# EasyEDA Pro project 旋变解码板_v2.2.epro, board PCB1_7
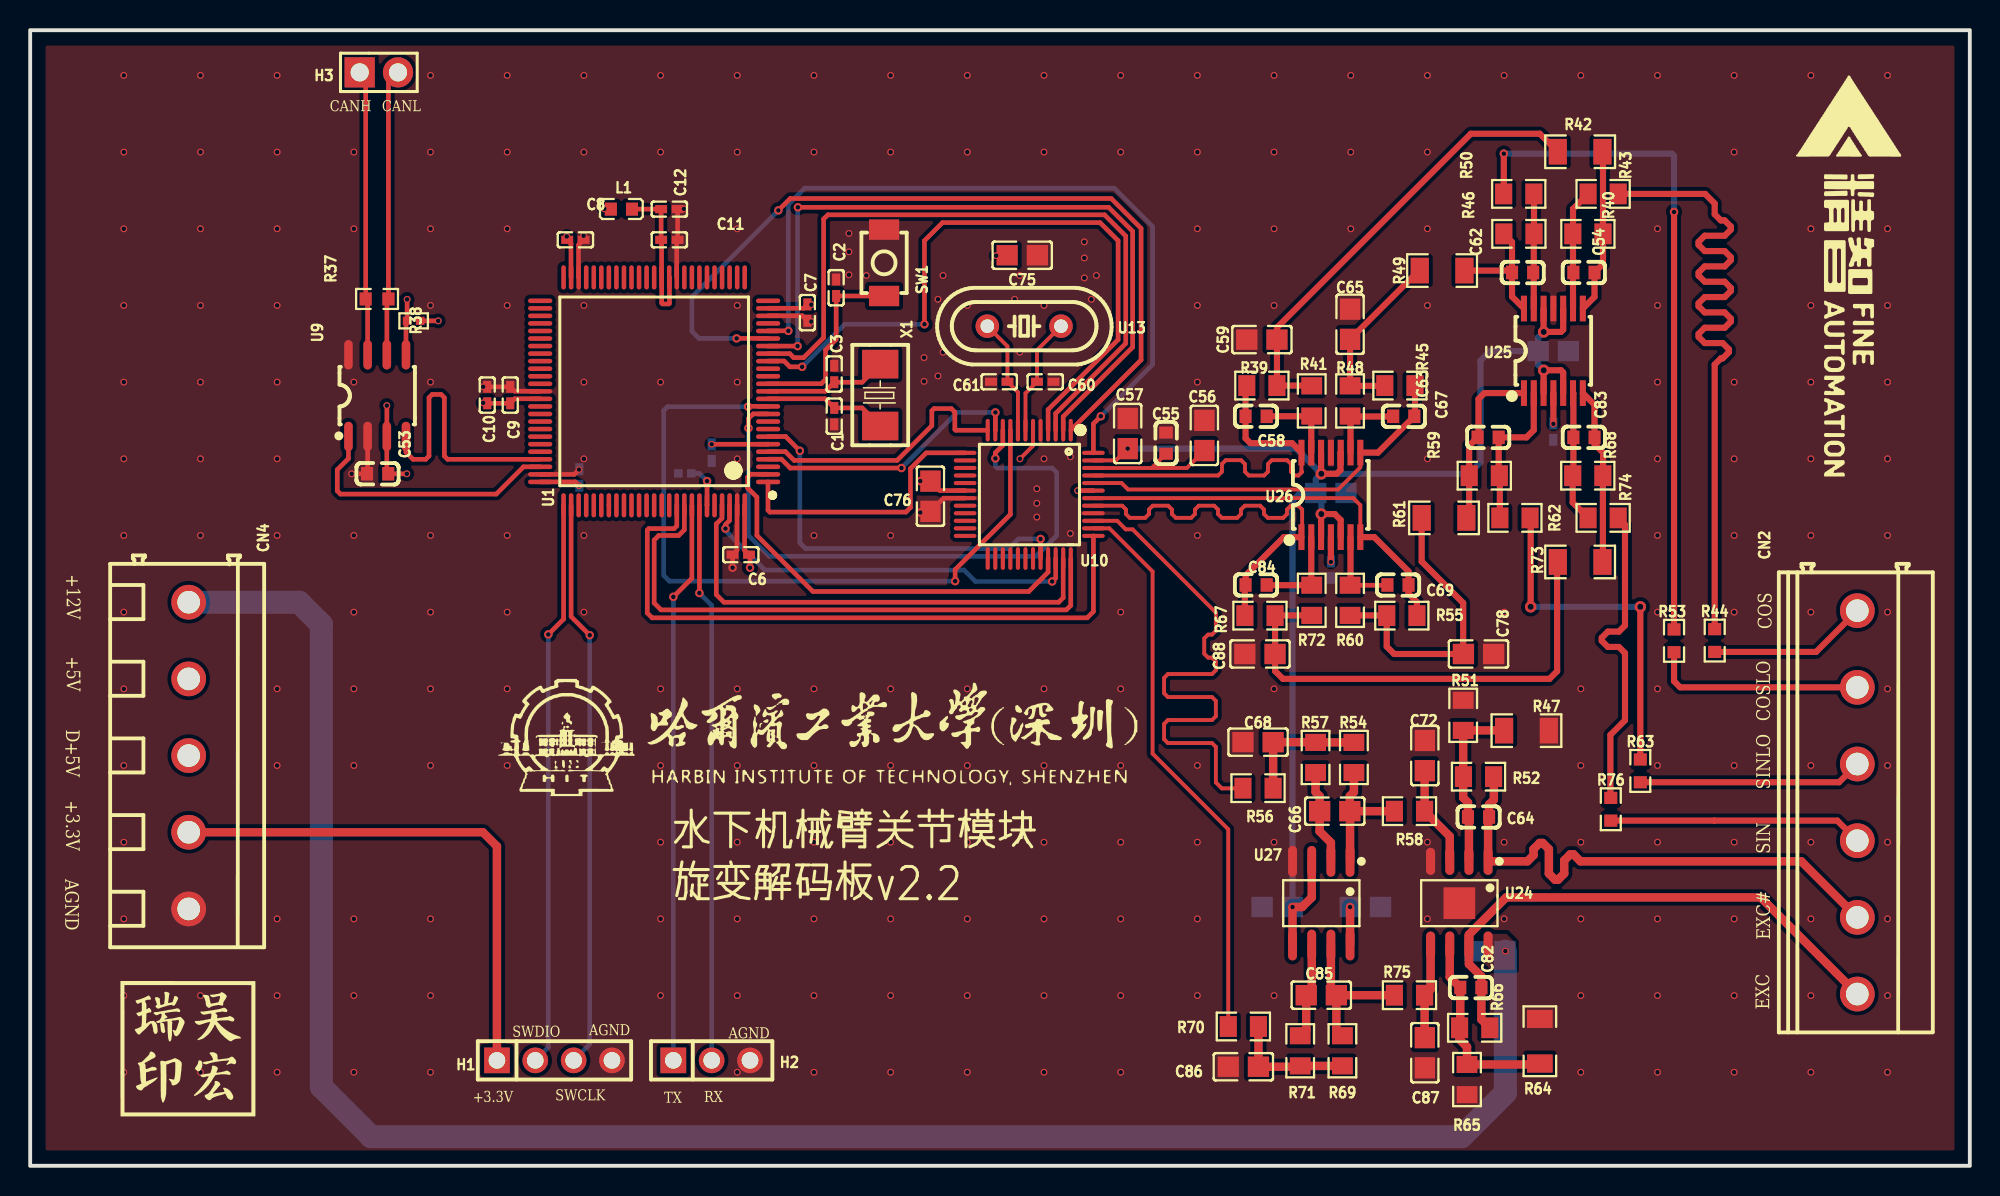
[diagram p4: board, top side]
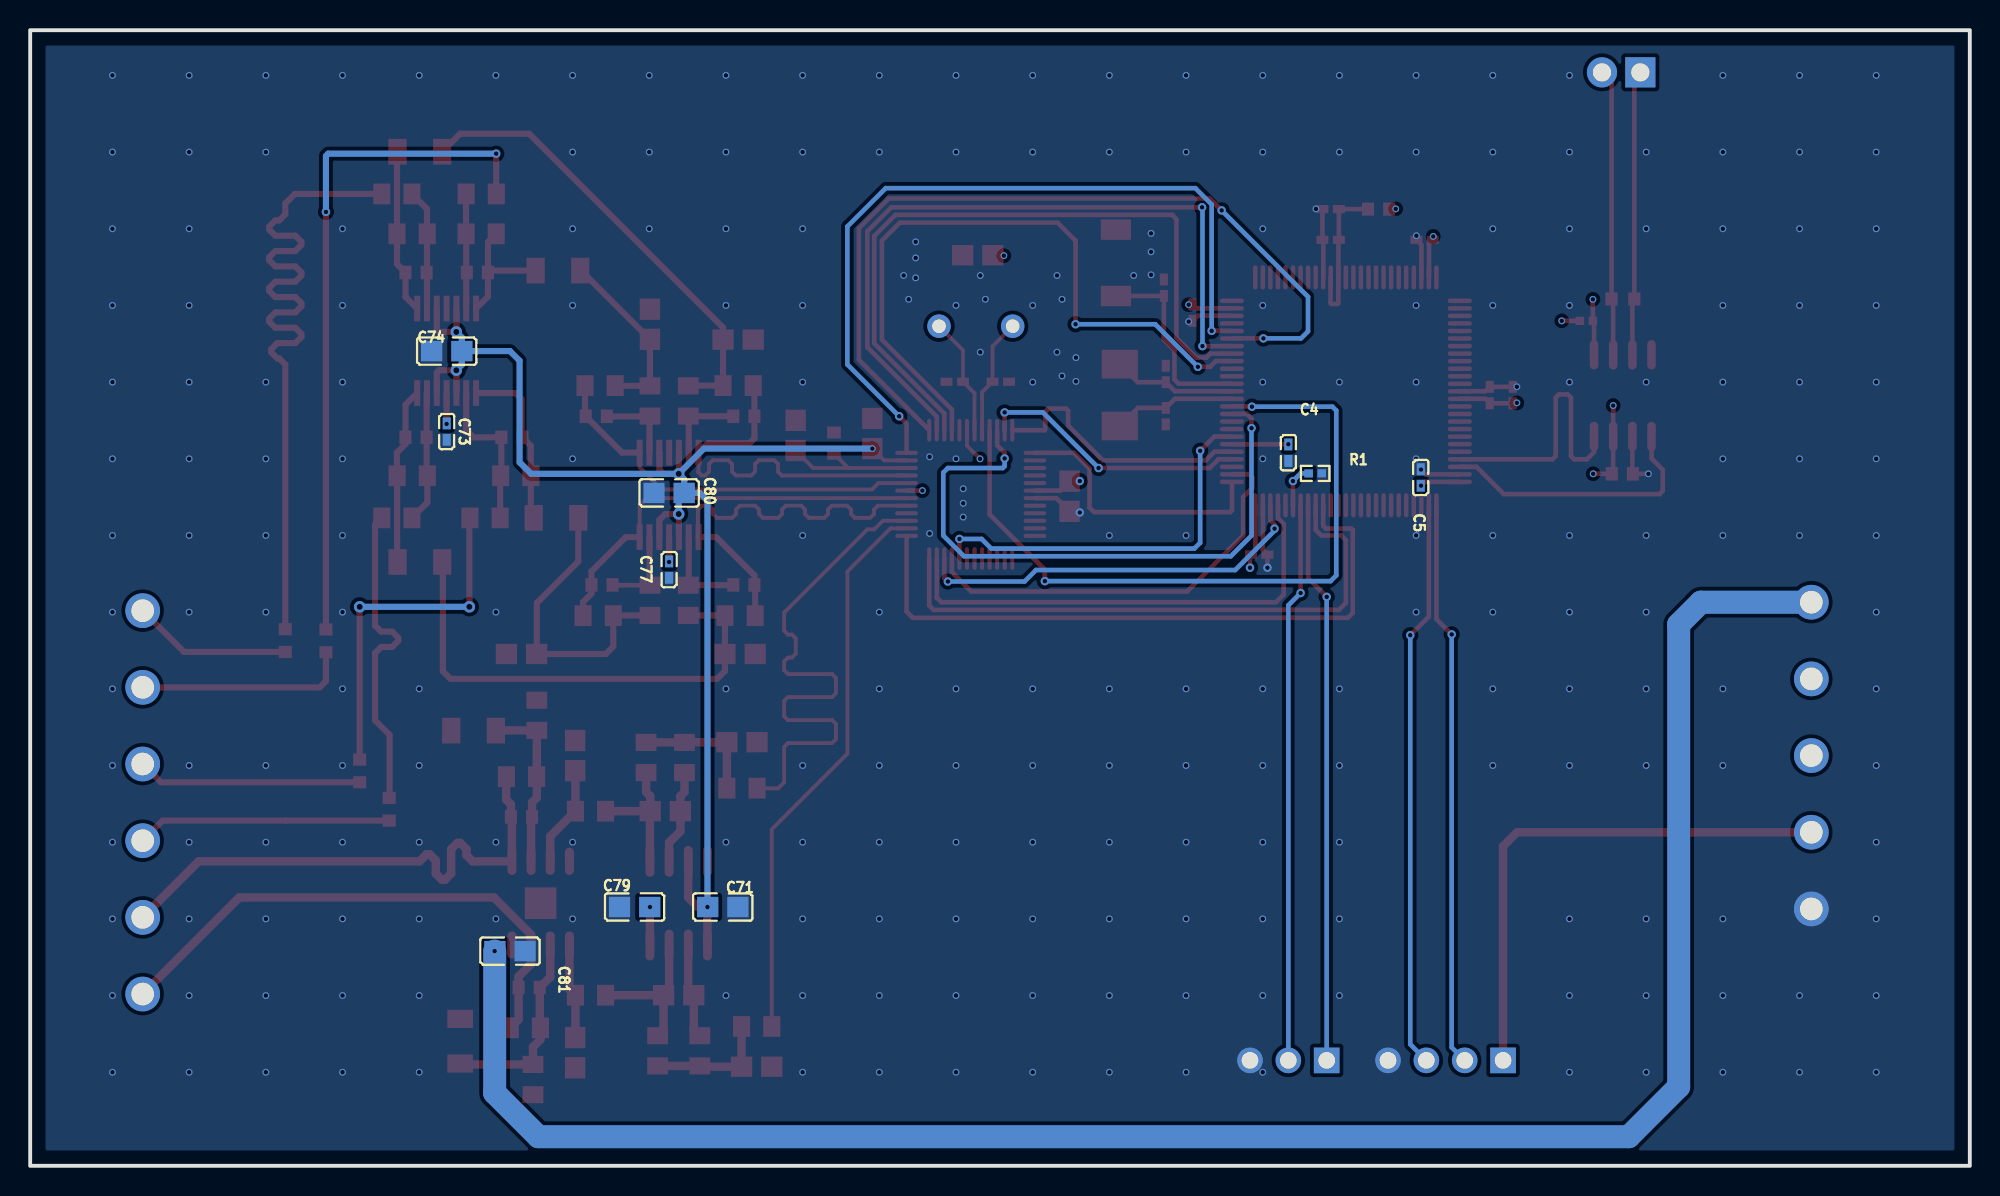
[diagram p5: board, bottom side, seen from below]

Outline 128.49 x 75.23 mm; copper layers: Top Layer, GND, PWR, Bottom Layer. Coordinates in mm from the lower left corner of the outline.
Outline path: rectangle 0,75.23 128.49,0
Stack: Top Layer 0.035mm 外层铜厚1oz / Dielectric1 0.2104mm 7628 RC49% 8.6mil / GND 0.0152mm 内层铜厚 / Dielectric2 1.065mm 1.1mm H/HOZ 含铜 / PWR 0.0152mm 内层铜厚 / Dielectric3 0.2104mm 7628 RC49% 8.6mil / Bottom Layer 0.035mm 外层铜厚1oz

## Design rules (mm)
net RX: USART
net TX: USART
net SWCLK: SWD
net SWDIO: SWD
net CAN_TX: CAN_TR
net CAN_RX: CAN_TR
net OSC_OUT: OSC
net OSC_IN: OSC
net DB14: AD2S1210_SPI
net DB15: AD2S1210_SPI
net CANH: CAN_HL
net CANL: CAN_HL
net EXC: EXC
net EXC#: EXC
net SIN: SIN
net SINLO: SIN
net COSLO: COS
net COS: COS
template: 自定义配置
spacing copperThickness1oz (default): track to track 0.102, other pairs 0.152 to 0.3
spacing copperThickness2oz: track to track 0.203, other pairs 0.152 to 0.3
track width copperThickness1oz (default): min 0.127, default 0.305, max 2.54
track width copperThickness2oz: min 0.203, default 0.254, max 2.54
differential pair differentialPair (default): width min 0.254, default 0.305, max 0.406; gap min 0.152, default 0.152
via viaSize (default): diameter min 0.254, default 0.457, max 10; hole min 0.3, default 0.305, max 6.299

## Placement (name value [footprint] x y rotation side)
C1  30pF  [C0402]  53.26 49.66 270 top
C2  100nF  [C0402]  53.39 58.17 270 top
C3  30pF  [C0402]  53.26 52.46 90 top
C4  100nF  [C0402]  45.14 47.24 90 bottom
C5  100nF  [C0402]  36.37 45.6 270 bottom
C6  100nF  [C0402]  47.07 40.49 0 top
C7  100nF  [C0402]  51.49 56.52 90 top
C8  100nF  [C0402]  36.12 61.35 180 top
C9  100nF  [C0402]  31.8 51.06 270 top
C10  4.7uF  [C0402]  30.28 51.06 270 top
C11  100nF  [C0402]  42.34 61.35 180 top
C12  1uF  [C0402]  42.34 63.38 180 top
C53  100nF  [C0603]  23.02 45.85 0 top
C54  120pF  [C0603]  102.93 59.18 0 top
C55  10nF  [C0603]  75.24 47.88 270 top
C56  10uF  [C0805]  77.78 48.39 270 top
C57  100nF  [C0805]  72.7 48.51 270 top
C58  680pF  [C0603]  81.21 49.66 0 top
C59  3.9nF  [C0805]  81.59 54.74 0 top
C60  30pF  [C0402]  67.24 51.94 0 top
C61  30pF  [C0402]  64.19 51.94 180 top
C62  120pF  [C0603]  98.86 59.18 180 top
C63  680pF  [C0603]  90.99 49.66 180 top
C64  2.7nF  [C0603]  95.94 23.11 180 top
C65  3.9nF  [C0805]  87.43 55.75 270 top
C66  56pF  [C0805]  86.42 23.5 0 top
C67  120pF  [C0603]  96.58 48.26 180 top
C68  470pF  [C0805]  81.34 28.07 0 top
C69  680pF  [C0603]  90.61 38.48 180 top
C71  100nF  [C0805]  82.61 17.14 0 bottom
C72  2.2nF  [C0805]  92.39 27.18 90 top
C73  1uF  [C0402]  100.9 48.64 90 bottom
C74  100nF  [C0805]  100.9 53.97 180 bottom
C75  100nF  [C0805]  65.72 60.33 180 top
C76  100nF  [C0805]  59.64 44.36 90 top
C77  1uF  [C0402]  86.17 39.5 90 bottom
C78  3.9nF  [C0805]  95.94 33.91 180 top
C79  10uF  [C0805]  88.45 17.14 180 bottom
C80  100nF  [C0805]  86.17 44.58 180 bottom
C81  10uF  [C0805]  96.71 14.22 0 bottom
C82  2.7nF  [C0603]  95.44 11.81 180 top
C83  120pF  [C0603]  102.93 48.26 0 top
C84  680pF  [C0603]  81.21 38.48 0 top
C85  56pF  [C0805]  85.53 11.3 0 top
C86  470pF  [C0805]  80.37 6.56 0 top
C87  2.2nF  [C0805]  92.39 7.49 270 top
C88  3.9nF  [C0805]  81.47 33.91 0 top
CN2  DB128V-5.08-6P-GN-S  [CONN-TH_6P-P5.08_DIBO_DB128V-5.08]  121.04 24.08 270 top
CN4  DB128V-5.08-5P-GN-S  [CONN-TH_5P-P5.08_DIBO_DB128V-5.08-5P-GN-S]  10.5 27.18 270 top
H1  PZ254V-11-04P  [HDR-TH_4P-P2.54-V-M]  34.73 6.99 0 top
H2  PZ254V-11-03P  [HDR-TH_3P-P2.54-V-M]  45.14 6.99 0 top
H3  PZ254V-11-02P  [HDR-TH_2P-P2.54-V-M]  23.1 72.44 0 top
L1  GZ1608D601TF  [L0603]  39.17 63.38 0 top
R1  10kΩ  [R0402]  43.37 45.87 180 bottom
R37  120Ω  [R0603]  22.98 57.43 180 top
R38  510Ω  [R0402]  25.4 55.98 0 top
R39  2kΩ  [R0805]  81.59 51.69 180 top
R40  22kΩ  [R0805]  103.19 61.74 0 top
R41  1.2kΩ  [R0805]  84.89 50.67 90 top
R42  4.7kΩ  [R1206]  102.67 67.18 0 top
R43  27kΩ  [R0805]  104.2 64.39 180 top
R44  0Ω  [R0603]  111.59 34.8 270 top
R45  2kΩ  [R0805]  90.74 51.69 0 top
R46  22kΩ  [R0805]  98.62 61.74 180 top
R47  750Ω  [R1206]  99.12 28.83 180 top
R48  1.2kΩ  [R0805]  87.43 50.67 90 top
R49  4.7kΩ  [R1206]  93.53 59.31 0 top
R50  27kΩ  [R0805]  98.61 64.39 0 top
R51  3.3kΩ  [R0805]  94.93 29.84 270 top
R52  910Ω  [R0805]  95.94 25.78 0 top
R53  0Ω  [R0603]  108.9 34.78 270 top
R54  20kΩ  [R0805]  87.69 27.05 270 top
R55  2kΩ  [R0805]  90.86 36.45 0 top
R56  20kΩ  [R0805]  81.34 25.02 0 top
R57  6.2kΩ  [R0805]  85.15 27.05 270 top
R58  820Ω  [R0805]  91.37 23.5 0 top
R59  22kΩ  [R0805]  96.33 45.72 180 top
R60  1.2kΩ  [R0805]  87.43 37.47 270 top
R61  4.7kΩ  [R1206]  93.66 42.93 0 top
R62  27kΩ  [R0805]  98.36 42.93 180 top
R63  0Ω  [R0603]  106.66 26.16 270 top
R64  750Ω  [R1206]  100.01 8.25 270 top
R65  3.3kΩ  [R0805]  95.18 5.72 90 top
R66  910Ω  [R0805]  95.69 9.14 0 top
R67  2kΩ  [R0805]  81.47 36.45 180 top
R68  22kΩ  [R0805]  103.18 45.72 0 top
R69  20kΩ  [R0805]  86.93 7.62 90 top
R70  20kΩ  [R0805]  80.37 9.23 0 top
R71  6.2kΩ  [R0805]  84.13 7.62 90 top
R72  1.2kΩ  [R0805]  84.89 37.47 270 top
R73  4.7kΩ  [R1206]  102.67 40 0 top
R74  27kΩ  [R0805]  104.2 42.93 180 top
R75  820Ω  [R0805]  91.37 11.3 0 top
R76  0Ω  [R0603]  104.71 23.62 270 top
SW1  TS-1185-B-B-B-A  [SW-SMD_L4.0-W3.0-LS5.0]  56.57 59.82 270 top
U1  STM32G474VET6  [LQFP-100_L14.0-W14.0-P0.50-LS16.0-BL]  41.33 51.31 90 top
U9  TJA1050T/CM,118  [SOIC-8_L5.0-W4.0-P1.27-LS6.0-BL]  22.99 51.02 0 top
U10  AD2S1210BSTZ  [LQFP-48_L7.0-W7.0-P0.50-LS9.0-BL]  66.18 44.48 180 top
U13  TX49S8.192M2LDBE2S  [HC-49S_L11.5-W5.0-P4.88]  65.85 55.63 180 top
U24  -  [SOP-8_L4.9-W3.9-P1.27-LS6.0-BL-EP2.1]  94.67 17.4 180 top
U25  -  [TSSOP-14_L5.0-W4.5-P0.65-LS6.4-BL]  100.9 54 0 top
U26  -  [TSSOP-14_L5.0-W4.5-P0.65-LS6.4-BL]  86.17 44.45 0 top
U27  AD8692ARZ-REEL7  [SOIC-8_L4.9-W3.9-P1.27-LS6.0-BL]  85.53 17.4 180 top
X1  8MHz  [CRYSTAL-SMD_L5.0-W3.2]  56.31 51.06 270 top

## Footprints (pads in the part's own frame, mm; a bottom-side part is the same pattern mirrored in y, then rotated)
C0402
  rect 0.79x0.54 smd: 1(-0.545,0) 2(0.545,0)
C0603
  rect 0.8x0.9 smd: 1(-0.7,0) 2(0.7,0)
C0805
  rect 1.41x1.35 smd: 1(-1,0) 2(1,0)
CONN-TH_5P-P5.08_DIBO_DB128V-5.08-5P-GN-S
  round 2.3 hole 1.5: 1(-10.16,0) 2(-5.08,0) 3(0,0) 4(5.08,0) 5(10.16,0)
CONN-TH_6P-P5.08_DIBO_DB128V-5.08
  round 2.3 hole 1.5: 1(-12.7,0) 2(-7.62,0) 3(-2.54,0) 4(2.54,0) 5(7.62,0) 6(12.7,0)
CRYSTAL-SMD_L5.0-W3.2
  rect 1.9x2.4 smd: 1(-2.05,0) 2(2.05,0)
HC-49S_L11.5-W5.0-P4.88
  round 1.56 hole 0.9: 1(-2.44,0) 2(2.44,0)
HDR-TH_2P-P2.54-V-M
  rect 2x2 hole 1.2: 1(-1.27,0)
  round 2 hole 1.2: 2(1.27,0)
HDR-TH_3P-P2.54-V-M
  rect 1.7x1.7 hole 1.1: 1(-2.54,0)
  round 1.7 hole 1.1: 2(0,0) 3(2.54,0)
HDR-TH_4P-P2.54-V-M
  rect 1.7x1.7 hole 1.1: 1(-3.81,0)
  round 1.7 hole 1.1: 2(-1.27,0) 3(1.27,0) 4(3.81,0)
L0603
  rect 0.8x0.864 smd: 1(-0.7,0) 2(0.7,0)
LQFP-48_L7.0-W7.0-P0.50-LS9.0-BL
  oval 0.27x1.5 smd: 1(-2.75,-4.25) 2(-2.25,-4.25) 3(-1.75,-4.25) 4(-1.25,-4.25) 5(-0.75,-4.25) 6(-0.25,-4.25) 7(0.25,-4.25) 8(0.75,-4.25) 9(1.25,-4.25) 10(1.75,-4.25) 11(2.25,-4.25) 12(2.75,-4.25) 25(2.75,4.25) 26(2.25,4.25) 27(1.75,4.25) 28(1.25,4.25) 29(0.75,4.25) 30(0.25,4.25) 31(-0.25,4.25) 32(-0.75,4.25) 33(-1.25,4.25) 34(-1.75,4.25) 35(-2.25,4.25) 36(-2.75,4.25)
  oval 1.5x0.27 smd: 13(4.25,-2.75) 14(4.25,-2.25) 15(4.25,-1.75) 16(4.25,-1.25) 17(4.25,-0.75) 18(4.25,-0.25) 19(4.25,0.25) 20(4.25,0.75) 21(4.25,1.25) 22(4.25,1.75) 23(4.25,2.25) 24(4.25,2.75) 37(-4.25,2.75) 38(-4.25,2.25) 39(-4.25,1.75) 40(-4.25,1.25) 41(-4.25,0.75) 42(-4.25,0.25) 43(-4.25,-0.25) 44(-4.25,-0.75) 45(-4.25,-1.25) 46(-4.25,-1.75) 47(-4.25,-2.25) 48(-4.25,-2.75)
LQFP-100_L14.0-W14.0-P0.50-LS16.0-BL
  oval 0.3x1.6 smd: 1(-6,-7.55) 2(-5.5,-7.55) 3(-5,-7.55) 4(-4.5,-7.55) 5(-4,-7.55) 6(-3.5,-7.55) 7(-3,-7.55) 8(-2.5,-7.55) 9(-2,-7.55) 10(-1.5,-7.55) 11(-1,-7.55) 12(-0.5,-7.55) 13(0,-7.55) 14(0.5,-7.55) 15(1,-7.55) 16(1.5,-7.55) 17(2,-7.55) 18(2.5,-7.55) 19(3,-7.55) 20(3.5,-7.55) 21(4,-7.55) 22(4.5,-7.55) 23(5,-7.55) 24(5.5,-7.55) 25(6,-7.55) 51(6,7.55) 52(5.5,7.55) 53(5,7.55) 54(4.5,7.55) 55(4,7.55) 56(3.5,7.55) 57(3,7.55) 58(2.5,7.55) 59(2,7.55) 60(1.5,7.55) 61(1,7.55) 62(0.5,7.55) 63(0,7.55) 64(-0.5,7.55) 65(-1,7.55) 66(-1.5,7.55) 67(-2,7.55) 68(-2.5,7.55) 69(-3,7.55) 70(-3.5,7.55) 71(-4,7.55) 72(-4.5,7.55) 73(-5,7.55) 74(-5.5,7.55) 75(-6,7.55)
  oval 1.6x0.3 smd: 26(7.55,-6) 27(7.55,-5.5) 28(7.55,-5) 29(7.55,-4.5) 30(7.55,-4) 31(7.55,-3.5) 32(7.55,-3) 33(7.55,-2.5) 34(7.55,-2) 35(7.55,-1.5) 36(7.55,-1) 37(7.55,-0.5) 38(7.55,0) 39(7.55,0.5) 40(7.55,1) 41(7.55,1.5) 42(7.55,2) 43(7.55,2.5) 44(7.55,3) 45(7.55,3.5) 46(7.55,4) 47(7.55,4.5) 48(7.55,5) 49(7.55,5.5) 50(7.55,6) 76(-7.55,6) 77(-7.55,5.5) 78(-7.55,5) 79(-7.55,4.5) 80(-7.55,4) 81(-7.55,3.5) 82(-7.55,3) 83(-7.55,2.5) 84(-7.55,2) 85(-7.55,1.5) 86(-7.55,1) 87(-7.55,0.5) 88(-7.55,0) 89(-7.55,-0.5) 90(-7.55,-1) 91(-7.55,-1.5) 92(-7.55,-2) 93(-7.55,-2.5) 94(-7.55,-3) 95(-7.55,-3.5) 96(-7.55,-4) 97(-7.55,-4.5) 98(-7.55,-5) 99(-7.55,-5.5) 100(-7.55,-6)
R0402
  rect 0.566x0.54 smd: 1(-0.433,0) 2(0.433,0)
R0603
  rect 0.806x0.864 smd: 1(-0.753,0) 2(0.753,0)
R0805
  rect 1.133x1.377 smd: 1(-1,0) 2(1,0)
R1206
  rect 1.208x1.701 smd: 1(-1.479,0) 2(1.479,0)
SOIC-8_L4.9-W3.9-P1.27-LS6.0-BL
  oval 0.588x2.045 smd: 1(-1.905,-2.772) 2(-0.635,-2.772) 3(0.635,-2.772) 4(1.905,-2.772) 5(1.905,2.772) 6(0.635,2.772) 7(-0.635,2.772) 8(-1.905,2.772)
SOIC-8_L5.0-W4.0-P1.27-LS6.0-BL
  oval 0.569x1.95 smd: 1(-1.905,-2.705) 2(-0.635,-2.705) 3(0.635,-2.705) 4(1.905,-2.705) 5(1.905,2.705) 6(0.635,2.705) 7(-0.635,2.705) 8(-1.905,2.705)
SOP-8_L4.9-W3.9-P1.27-LS6.0-BL-EP2.1
  oval 0.6x1.8 smd: 1(-1.905,-2.772) 2(-0.635,-2.772) 3(0.635,-2.772) 4(1.905,-2.772) 5(1.905,2.772) 6(0.635,2.772) 7(-0.635,2.772) 8(-1.905,2.772)
  rect 2.1x2.1 smd: 9(0,0)
SW-SMD_L4.0-W3.0-LS5.0
  rect 1.35x2 smd: 1(-2.2,0) 2(2.2,0)
TSSOP-14_L5.0-W4.5-P0.65-LS6.4-BL
  rect 0.4x1.7 smd: 1(-1.95,-2.8) 2(-1.3,-2.8) 3(-0.65,-2.8) 4(0,-2.8) 5(0.65,-2.8) 6(1.3,-2.8) 7(1.95,-2.8) 8(1.95,2.8) 9(1.3,2.8) 10(0.65,2.8) 11(0,2.8) 12(-0.65,2.8) 13(-1.3,2.8) 14(-1.95,2.8)

## Nets
As in the schematic.

Pads without a net: U1 3 8 9 15 16 22 25 26 27 28 29 30 31 32 33 34 38 39 40 41 42 43 44 45 46 47 50 51 52 53 54 55 56 57 58 59 60 61 62 65 66 67 68 69 70 71 78 79 80 81 82 83 84 85 86 87 88 89 90 96; U10 14 15 16 17 20 21 22 23 24 25 26 27 28 29 30 31

## Via types
v1: diameter 0.457, hole 0.305, Top Layer to Bottom Layer, 268 vias
v2: diameter 0.559, hole 0.305, Top Layer to Bottom Layer, 29 vias
v3: diameter 0.45, hole 0.3, Top Layer to Bottom Layer, 9 vias
v4: diameter 0.762, hole 0.406, Top Layer to Bottom Layer, 6 vias

## Routing (per net, layer and track width the routed paths; a pad name or vN(x,y) marks a point on that pad's centre or on a via; arc(x,y) is an arc through that point)
+3.3V: length 60.3
  Top Layer w0.305: v2(58.96,45.36) 59.63,45.36 C76.2 60.26,44.73 U10.18 ; 47.33,43.77 47.33,40.78 C6.2 47.68,40.42 v2(47.68,39.62) ; v3(36.36,45.06) 36.11,45.31 U1.75 ; 35.83,58.87 35.83,61.1 C8.2 35.54,61.38 v1(35.54,61.57) ; 33.78,50.82 32.1,50.82 C9.2 C10.2 30.25,50.55 v1(30.01,50.55) ; 48.88,47.82 48.86,47.8 v3(45.14,47.8) ; v1(38.03,63.4) 38.45,63.4 ; 48.88,56.82 51.23,56.82 C7.2 51.51,57.05 v1(51.75,57.05) ; 25.83,55.98 v1(27.03,55.98)
  Top Layer w0.559: CN4.4 29.99,22.1 30.92,21.17 H1.1
  Bottom Layer w0.305: v3(45.14,47.8) C4.2
+5V: length 13.1
  Top Layer w0.305: v1(23.62,50.37) 23.63,50.36 23.63,48.32 U9.3 23.62,45.94 C53.2 v1(24.95,45.85) ; v1(69.38,44.73) U10.43
  Top Layer w0.406: v3(86.17,40) U26.4 ; U25.4 v3(100.9,49.15)
  Top Layer w0.559: v3(87.43,17.14) U27.8
  Bottom Layer w0.406: C73.2 100.9,49.16 v3(100.9,49.15)
+12V: length 130.4
  Bottom Layer w1.524: CN4.1 17.81,37.34 19.29,35.86 19.29,5.23 22.59,1.93 94.83,1.93 97.72,4.83 v3(97.72,14.22)
AGND: length 28.7
  Top Layer w0.305: U10.19 60.51,44.23 C76.1 59.56,43.28 v2(58.96,43.28) ; v2(46.53,39.62) C6.1 46.83,40.78 46.83,43.77 ; 42.83,58.87 42.83,61.29 42.89,61.35 42.89,63.38 42.9,63.4 v1(43.31,63.4) ; 33.78,51.32 32.09,51.32 C9.1 C10.1 30.27,51.61 v1(30.01,51.61) ; U1.74 36.04,45.81 v3(36.36,46.13) ; 36.33,58.87 36.33,61.01 C8.1 36.66,61.35 v1(36.66,61.62) ; v1(51.75,55.93) 51.53,55.93 C7.1 51.15,56.32 48.88,56.32 ; v1(21.29,45.85) C53.1 22.35,45.85 U9.2
  vias: v1(6.2,72.24) v1(6.2,67.16) v1(6.2,62.08) v1(6.2,57) v1(6.2,51.92) v1(6.2,46.84) v1(6.2,41.76) v1(6.2,36.68) v1(6.2,31.6) v1(6.2,26.52) v1(6.2,21.44) v1(6.2,16.36) v1(6.2,11.28) v1(6.2,6.2) v1(11.28,72.24) v1(11.28,67.16) v1(11.28,62.08) v1(11.28,57) v1(11.28,51.92) v1(11.28,46.84) v1(11.28,41.76) v1(11.28,11.28) v1(11.28,6.2) v1(16.36,72.24) v1(16.36,67.16) v1(16.36,62.08) v1(16.36,57) v1(16.36,51.92) v1(16.36,46.84) v1(16.36,41.76) v1(16.36,31.6) v1(16.36,26.52) v1(16.36,16.36) v1(16.36,11.28) v1(16.36,6.2) v1(21.44,67.16) v1(21.44,62.08) v1(21.44,51.92) v1(21.44,41.76) v1(21.44,36.68) v1(21.44,31.6) v1(21.44,26.52) v1(21.44,16.36) v1(21.44,11.28) v1(21.44,6.2) v1(26.52,72.24) v1(26.52,67.16) v1(26.52,62.08) v1(26.52,57) v1(26.52,51.92) v1(26.52,41.76) v1(26.52,36.68) v1(26.52,31.6) v1(26.52,26.52) v1(26.52,16.36) v1(26.52,11.28) v1(26.52,6.2) v1(31.6,72.24) v1(31.6,67.16) v1(31.6,62.08) v1(31.6,57) v1(31.6,41.76) v1(31.6,36.68) v1(31.6,31.6) v1(31.6,26.52) v1(36.68,72.24) v1(36.68,67.16) v1(36.68,57) v1(36.68,51.92) v1(36.68,46.84) v1(36.68,41.76) v1(36.68,36.68) v1(41.76,72.24) v1(41.76,67.16) v1(41.76,51.92) v1(41.76,31.6) v1(41.76,26.52) v1(41.76,21.44) v1(41.76,16.36) v1(41.76,11.28) v1(46.84,72.24) v1(46.84,67.16) v1(46.84,62.08) v1(46.84,57) v1(46.84,51.92) v1(46.84,46.84) v1(46.84,31.6) v1(46.84,26.52) v1(46.84,21.44) v1(46.84,16.36) v1(46.84,11.28) v1(46.84,6.2) v1(51.92,72.24) v1(51.92,67.16) v1(51.92,41.76) v1(51.92,31.6) v1(51.92,26.52) v1(51.92,21.44) v1(51.92,16.36) v1(51.92,11.28) v1(51.92,6.2) v1(54.24,61.77) v1(54.24,60.55) v1(54.24,59.03) v1(55.39,58.98) v1(57,72.24) v1(57,67.16) v1(57,41.76) v1(57,31.6) v1(57,26.52) v1(57,21.44) v1(57,16.36) v1(57,11.28) v1(57,6.2) v1(59.22,53.54) v1(59.22,51.97) v1(60.14,57.41) v1(60.14,52.33) v1(60.47,58.98) v1(60.47,53.9) v1(62.08,72.24) v1(62.08,67.16) v1(62.08,57) v1(62.08,51.92) v1(62.08,31.6) v1(62.08,26.52) v1(62.08,21.44) v1(62.08,16.36) v1(62.08,11.28) v1(62.08,6.2) v1(65.22,57.41) v1(65.55,58.98) v1(65.55,53.9) v1(66.68,44.86) v1(66.68,43.89) v1(66.68,42.98) v1(67.16,72.24) v1(67.16,67.16) v1(67.16,57) v1(67.16,46.84) v1(67.16,31.6) v1(67.16,26.52) v1(67.16,21.44) v1(67.16,16.36) v1(67.16,11.28) v1(67.16,6.2) v1(68.91,46.97) v1(68.91,41.89) v1(69.83,61.21) v1(69.83,60.15) v1(69.83,58.83) v1(70.3,57.41) v1(70.63,58.98) v1(72.24,72.24) v1(72.24,67.16) v1(72.24,36.68) v1(72.24,31.6) v1(72.24,26.52) v1(72.24,21.44) v1(72.24,16.36) v1(72.24,11.28) v1(72.24,6.2) v1(77.32,72.24) v1(77.32,67.16) v1(77.32,62.08) v1(77.32,57) v1(77.32,51.92) v1(77.32,41.76) v1(77.32,26.52) v1(77.32,21.44) v1(77.32,16.36) v1(77.32,11.28) v1(77.32,6.2) v1(82.4,72.24) v1(82.4,67.16) v1(82.4,62.08) v1(82.4,57) v1(82.4,31.6) v1(82.4,21.44) v1(82.4,11.28) v1(87.48,72.24) v1(87.48,67.16) v1(87.48,62.08) v1(92.56,72.24) v1(92.56,67.16) v1(92.56,62.08) v1(92.56,57) v1(92.56,46.84) v1(92.56,21.44) v1(92.56,16.36) v1(97.64,72.24) v1(97.64,36.68) v1(97.64,21.44) v1(97.64,16.36) v1(102.72,72.24) v1(102.72,31.6) v1(102.72,26.52) v1(102.72,21.44) v1(102.72,16.36) v1(102.72,11.28) v1(102.72,6.2) v1(107.8,72.24) v1(107.8,62.08) v1(107.8,57) v1(107.8,51.92) v1(107.8,46.84) v1(107.8,41.76) v1(107.8,36.68) v1(107.8,31.6) v1(107.8,26.52) v1(107.8,21.44) v1(107.8,16.36) v1(107.8,11.28) v1(107.8,6.2) v1(112.88,72.24) v1(112.88,67.16) v1(112.88,51.92) v1(112.88,46.84) v1(112.88,41.76) v1(112.88,36.68) v1(112.88,26.52) v1(112.88,21.44) v1(112.88,16.36) v1(112.88,11.28) v1(112.88,6.2) v1(117.96,72.24) v1(117.96,67.16) v1(117.96,62.08) v1(117.96,57) v1(117.96,51.92) v1(117.96,46.84) v1(117.96,41.76) v1(117.96,36.68) v1(117.96,26.52) v1(117.96,21.44) v1(117.96,16.36) v1(117.96,11.28) v1(117.96,6.2) v1(123.04,72.24) v1(123.04,67.16) v1(123.04,62.08) v1(123.04,57) v1(123.04,51.92) v1(123.04,46.84) v1(123.04,41.76) v1(123.04,36.68) v1(123.04,31.6) v1(123.04,26.52) v1(123.04,21.44) v1(123.04,16.36) v1(123.04,11.28) v1(123.04,6.2)
(no net): length 0
  Top Layer w0.305: 38.34,43.76 U1.82
A0: length 43.8
  Top Layer w0.305: U10.37 70.43,36.72 70.02,36.3 41.2,36.3 40.88,36.63 40.88,42.11 40.98,42.22 42.66,42.22 42.83,42.39 U1.91
A1: length 39.1
  Top Layer w0.305: U10.36 68.93,37.12 68.64,36.83 41.79,36.83 41.33,37.29 41.33,41.45 41.64,41.76 42.96,41.76 43.33,42.13 U1.92
CAN_RX: length 18.2
  Top Layer w0.305: U9.4 24.89,47.28 25.36,46.81 26.2,46.81 26.42,47.02 26.42,50.89 26.64,51.11 27.22,51.11 27.44,50.89 27.44,47.02 27.65,46.81 U1.72
CAN_TX: length 18.2
  Top Layer w0.305: U9.1 21.08,46.86 20.34,46.11 20.34,44.72 20.56,44.5 30.87,44.5 32.68,46.31 U1.73
CANH: length 18.9
  Top Layer w0.305: H3.1 22.23,72.04 R37.2 22.35,57.3 U9.7
CANL: length 19
  Top Layer w0.305: 24.37,72.44 23.73,71.81 R37.1 23.63,57.33 23.63,53.73 U9.6
COS: length 25.9
  Top Layer w0.254: U10.45 78.69,45.73 78.95,45.99 78.95,46.49 79.2,46.75 80.22,46.75 80.47,46.49 80.47,45.99 80.73,45.73 81.74,45.73 82,45.99 82,46.49 82.25,46.75 83.27,46.75 83.52,46.49 83.52,45.99 83.77,45.73 84.02,45.73 84.26,45.97 84.21,46.02 U26.14
  Top Layer w0.406: 80.61,51.9 80.51,51.81 C58.1 80.51,48.2 80.83,47.88 83.59,47.88 U26.14
COSLO: length 26.1
  Top Layer w0.254: U10.44 72.3,45.23 72.73,44.81 86.65,44.81 88.11,46.27 U26.8
  Top Layer w0.406: C63.1 89.28,47.25 U26.8 ; 91.74,51.82 91.74,49.7
CS#: length 49.1
  Top Layer w0.305: v2(50.83,54.31) 48.86,54.31 ; U10.2 68.43,49.64 73.03,54.24 73.03,61.91 71.44,63.5 v2(50.86,63.5)
  Bottom Layer w0.305: v2(50.86,63.5) 50.83,63.47 v2(50.83,54.31)
D+5V: length 3
  Top Layer w0.254: U10.6 66.43,47.7 v1(65.57,46.84)
  Top Layer w0.305: v1(63.99,60.3) 64.69,60.3 C75.2
DB13: length 18.1
  Top Layer w0.305: 48.88,45.32 48.88,43.43 49,43.31 58.01,43.31 58.31,43.61 58.31,46.19 59.36,47.23 U10.13
DB14: length 18.1
  Top Layer w0.305: 48.88,47.32 50.03,47.32 50.61,46.74 57.43,46.74 59.73,49.04 59.73,50.02 59.88,50.17 61.02,50.17 61.25,49.93 61.25,48.79 61.31,48.73 U10.12
DB15: length 18
  Top Layer w0.305: v2(57.72,46.23) 50.35,46.23 49.76,46.82 48.88,46.82 ; v2(63.94,49.91) 63.94,48.74 U10.11
  Bottom Layer w0.305: v2(63.94,49.91) 61.4,49.91 v2(57.72,46.23)
DIR: length 26.3
  Top Layer w0.305: 48.88,48.32 50.04,48.32 v2(50.99,47.37) ; U10.32 v2(66.93,41.53)
  Bottom Layer w0.305: v2(66.93,41.53) 65.46,41.53 64.83,40.89 51.37,40.89 50.99,41.28 v2(50.99,47.37)
DOS: length 32
  Top Layer w0.305: 45.83,43.77 45.83,42.9 45.45,42.52 45.45,37.85 45.96,37.34 68.13,37.34 68.43,37.64 U10.35
EXC: length 37.3
  Top Layer w0.254: U10.38 71.49,42.23 74.35,39.37 74.35,27.31 79.37,22.29 R70.1
EXC#: length 37.2
  Top Layer w0.254: U10.39 72.01,42.73 72.58,42.16 73.03,42.16 78.55,36.65 78.55,35.45 78.29,35.19 78.03,35.19 77.78,34.94 77.78,33.92 78.03,33.67 78.29,33.67 78.55,33.42 78.55,32.83 78.29,32.58 75.37,32.58 75.12,32.32 75.12,31.31 75.37,31.05 78.29,31.05 78.55,30.8 78.55,29.78 78.29,29.53 75.37,29.53 75.12,29.28 75.12,28.26 75.37,28.01 78.29,28.01 78.55,27.75 78.55,25.4 78.94,25 80.21,25
LOT: length 26.5
  Top Layer w0.305: U10.34 67.93,38.94 v2(67.7,38.71) ; 46.33,43.77 46.33,42.75 46.06,42.48 v2(46.06,42.22)
  Bottom Layer w0.305: v2(46.06,42.22) 46.06,42.08 48.66,39.47 61.86,39.47 62.62,38.71 v2(67.7,38.71)
NRST: length 12.9
  Top Layer w0.305: SW1.2 56.56,57.63 C2.2 53.39,54.74 52.69,54.04 52.69,52.1 52.41,51.82 48.88,51.82
OSC_IN: length 8.2
  Top Layer w0.305: 48.88,50.82 52.66,50.82 C1.1 55.11,50.21 X1.2
OSC_OUT: length 8.2
  Top Layer w0.305: 48.88,51.32 52.67,51.32 C3.1 55.11,51.91 X1.1
RD#: length 47.7
  Top Layer w0.305: U10.3 67.93,49.84 72.58,54.48 72.58,61.59 71.17,63 52.84,63 52.56,62.72 52.56,54.86 51.24,53.54 50.58,53.54 50.31,53.81 U1.18
RES0: length 52
  Top Layer w0.305: 48.88,55.32 v2(50.22,55.32) ; U10.48 70.43,49.16 v2(70.92,49.66)
  Bottom Layer w0.305: v2(50.22,55.32) 50.22,63.69 51.3,64.77 71.81,64.77 74.35,62.23 74.35,53.09 v2(70.92,49.66)
RES1: length 56.1
  Top Layer w0.305: U10.1 73.59,53.39 73.59,62.1 71.61,64.08 50.35,64.08 v2(49.56,63.3) ; v2(46.8,54.82) 48.88,54.82
  Bottom Layer w0.305: v2(46.8,54.82) 44.3,54.82 43.84,55.28 43.84,57.57 v2(49.56,63.3)
RESET#: length 27.8
  Top Layer w0.305: 48.88,45.82 47.74,45.82 47.73,45.82 47.53,45.62 47.53,44.91 48.14,44.3 48.14,41.76 51.85,38.05 66.15,38.05 67.43,39.33 U10.33
RX: length 37.1
  Top Layer w0.305: U1.94 44.33,37.95 v2(44.33,37.95)
  Bottom Layer w0.305: H2.2 45.14,37.14 v2(44.33,37.95)
SAMPLE#: length 41.7
  Top Layer w0.305: v2(63.94,46.86) 63.94,47.24 64.43,47.74 U10.10 ; 48.88,49.82 47.89,49.82 47.58,49.5 v2(47.58,48.87)
  Bottom Layer w0.305: v2(63.94,46.86) 63.94,46.36 64.07,46.23 67.7,46.23 68,45.92 68,41.76 66.63,40.39 48.95,40.39 47.58,41.76 v2(47.58,48.87)
SIN: length 27.3
  Top Layer w0.254: U26.1 84.26,41.69 84.26,43.48 84.01,43.73 83.51,43.73 83.26,43.48 83.26,43.18 83,42.93 81.99,42.93 81.73,43.18 81.73,43.48 81.48,43.73 80.46,43.73 80.21,43.48 80.21,43.18 79.95,42.93 78.94,42.93 78.68,43.18 78.68,43.48 78.43,43.73 77.42,43.73 77.16,43.48 77.16,43.18 76.91,42.93 75.89,42.93 75.64,43.18 75.64,43.48 75.38,43.73 74.37,43.73 74.11,43.48 74.11,43.18 73.86,42.93 72.84,42.93 72.59,43.18 72.59,43.48 72.33,43.73 U10.41
  Top Layer w0.406: R67.2 80.47,38.44 C84.1 80.51,39.12 83.05,41.65 U26.1
SINLO: length 27.3
  Top Layer w0.254: U26.7 88.11,43.77 87.65,44.23 U10.42
  Top Layer w0.406: U26.7 89.04,41.65 91.31,39.38 C69.1 91.31,37.91 91.86,37.35 R55.2
SOE#: length 48.9
  Top Layer w0.305: 48.88,50.32 47.58,50.32 v2(47.56,50.29) ; v2(61.27,38.73) 61.27,39.5 64.93,43.16 U10.9
  Bottom Layer w0.305: v2(47.56,50.29) 42.22,50.29 41.97,50.04 41.97,39.12 42.35,38.73 v2(61.27,38.73)
SWCLK: length 37.7
  Top Layer w0.305: U1.77 35.83,36.39 v2(37.07,35.15)
  Bottom Layer w0.305: v2(37.07,35.15) 37.07,8.05 H1.3
SWDIO: length 37.5
  Top Layer w0.305: U1.76 35.33,36.22 v2(34.32,35.2)
  Bottom Layer w0.305: v2(34.32,35.2) 34.32,7.85 H1.2
TX: length 37.3
  Top Layer w0.305: v2(42.6,37.69) 43.83,38.92 U1.93
  Bottom Layer w0.305: H2.1 v2(42.6,37.69)
VREF: length 95.3
  Top Layer w0.254: v3(72.7,47.51) 71.92,46.73 U10.47
  Top Layer w0.406: U25.12 100.25,55.25 v4(100.26,55.25) 101.4,55.25 101.55,55.39 U25.10 ; U25.5 101.55,52.56 101.4,52.7 v4(100.26,52.7) 100.25,52.7 U25.3 ; U26.5 86.82,42.78 86.42,43.18 v4(85.53,43.18) 85.52,43.17 U26.3 ; U26.12 85.52,45.86 v4(85.53,45.85) 86.55,45.85 86.8,46.1 86.8,47.23 U26.10
  Top Layer w0.559: U27.3 84.89,17.78 84.26,17.14 v3(83.63,17.14) U27.5
  Bottom Layer w0.406: v4(100.26,52.7) 99.9,53.07 C74.2 ; v4(85.53,43.18) 85.53,44.21 C80.2 ; C80.2 84.13,44.58 83.63,44.07 v3(83.63,17.14) ; C80.2 85.17,45.48 v4(85.53,45.85) ; v3(72.7,47.51) 83.86,47.51 v4(85.53,45.85) ; C74.2 96.71,53.97 96.07,53.34 96.07,46.61 95.31,45.85 v4(85.53,45.85) ; C74.2 99.9,54.88 v4(100.26,55.25)
WR#/FSYNC#: length 45.5
  Top Layer w0.305: 48.88,53.32 49.94,53.32 50.33,52.93 v2(51.14,52.93) ; U10.4 67.43,50.1 72.07,54.74 72.07,61.29 70.87,62.48 60.43,62.48 59.24,61.29 v2(59.24,55.75)
  Bottom Layer w0.305: v2(59.24,55.75) 53.96,55.75 v2(51.14,52.93)
$1N2896: length 10.4
  Top Layer w0.305: U1.37 41.83,57.16 41.89,57.1 42.3,57.1 42.35,57.15 42.35,58.84 U1.36 ; L1.2 C12.2 C11.2 41.83,60.93 41.83,58.87
$1N3277: length 2.9
  Top Layer w0.305: U1.95 44.84,43.76 v2(44.84,45.36)
  Bottom Layer w0.305: R1.1 44.33,45.87 v2(44.84,45.36)
$5N19775: length 3.7
  Top Layer w0.305: U9.5 24.89,55.9 R38.1 v1(24.97,57.4)
$6N5803: length 9.2
  Top Layer w0.254: 74.3,46.23 76.63,46.23 C56.2 ; 74.3,46.23 U10.46 ; 74.3,46.23 C55.2
$6N5807: length 11
  Top Layer w0.406: R42.2 104.19,67.15 R40.2 104.19,59.74 C54.2 103.63,57.57 U25.8
$6N5855: length 6.3
  Top Layer w0.559: U27.2 86.17,21.41 85.42,22.16 C66.1 85.42,24.5 85.15,24.77 R57.2
$6N5857: length 8.4
  Top Layer w0.559: R54.1 R57.1 85.13,28.07 C68.2 R56.2
$6N5858: length 9
  Top Layer w0.559: U27.1 87.43,23.48 C66.2 ; C66.2 87.42,24.5 87.69,24.77 R54.2 ; C66.2 R58.1
$6N5861: length 6.7
  Top Layer w0.559: C72.1 92.37,26.16 R58.2 94.04,21.83 U24.3
$6N5864: length 11.6
  Top Layer w0.559: 94.93,25.77 R51.2 97.62,28.84 R47.2 ; 94.93,25.77 R52.1 ; 94.93,25.77 94.93,24.38 95.24,24.07 C64.2 95.31,23.05 U24.2
$6N5868: length 6.3
  Top Layer w0.559: U27.6 84.89,11.67 C85.1 84.53,9.02 R71.2
$6N5870: length 8.3
  Top Layer w0.559: R70.2 C86.2 84.08,6.56 R71.1 R69.1
$6N5871: length 10.2
  Top Layer w0.559: C85.2 86.53,9.02 R69.2 ; C85.2 86.17,11.67 U27.7 ; C85.2 R75.1
$6N5874: length 6.3
  Top Layer w0.559: C87.1 92.37,8.51 R75.2 92.77,11.7 U24.5
$6N5877: length 13.3
  Top Layer w0.559: U24.6 94.04,12.51 C82.2 94.74,9.19 R66.1 94.69,8.37 95.18,7.87 R65.2 99.95,6.72 R64.2
$6N5880: length 35.9
  Top Layer w0.559: R52.2 96.96,25.77 96.96,24.26 96.64,23.94 C64.1 96.58,23.05 U24.1 99.18,20.17 99.59,20.58 99.59,20.98 99.99,21.39 100.2,21.39 100.61,20.98 100.61,19.36 101.01,18.96 101.21,18.96 101.62,19.36 101.62,20.23 102.03,20.64 102.23,20.64 102.7,20.17 117.33,20.17 121.04,16.46
$6N5881: length 36.1
  Top Layer w0.559: R66.2 96.14,9.7 C82.1 96.14,12.54 95.31,13.37 U24.7 95.31,15.32 97.77,17.78 114.64,17.78 CN2.6
$6N9575: length 32.3
  Top Layer w0.406: 84.77,36.47 82.48,36.47 R67.1 82.47,32.78 82.99,32.26 100.64,32.26 101.15,32.77 101.15,39.96 R73.1
$6N9581: length 19.9
  Top Layer w0.406: R60.2 89.85,36.47 R55.1 89.86,34.4 90.36,33.91 C78.2 94.93,33.92 94.93,37.29 92.18,40.04 R61.1
$6N9587: length 11.9
  Top Layer w0.406: R49.1 91.99,59.31 C65.2 R48.2 89.72,51.67 R45.1
$6N9593: length 30.6
  Top Layer w0.406: R42.1 100,68.38 95.44,68.38 82.59,55.53 C59.2 R39.1 84.88,51.69 R41.2
$6N9635: length 10.6
  Top Layer w0.406: R44.2 118.3,34.04 CN2.1
$6N9636: length 49
  Top Layer w0.406: R43.1 110.96,64.39 111.59,63.75 111.59,63.04 112,62.63 112.25,62.63 112.66,62.23 112.66,62.02 112.25,61.62 110.93,61.62 110.52,61.21 110.52,61.01 110.93,60.6 112.25,60.6 112.66,60.2 112.66,59.99 112.25,59.59 110.93,59.59 110.52,59.18 110.52,58.98 110.93,58.57 112.25,58.57 112.66,58.16 112.66,57.96 112.25,57.55 110.93,57.55 110.52,57.15 110.52,56.94 110.93,56.54 112.25,56.54 112.66,56.13 112.66,55.93 112.25,55.52 110.93,55.52 110.52,55.12 110.52,54.91 110.93,54.51 112.12,54.51 112.52,54.1 112.52,53.9 112.12,53.49 112,53.49 111.59,53.08 R44.1
$6N9679: length 14.2
  Top Layer w0.406: CN2.2 109.3,31.7 108.9,32.11 R53.2
$6N9680: length 45.4
  Top Layer w0.406: R50.1 97.62,64.4 v2(97.62,67.06) ; R53.1 v2(108.9,63.19)
  Bottom Layer w0.406: v2(97.62,67.06) 108.75,67.06 108.9,66.9 v2(108.9,63.19)
$6N9724: length 14.9
  Top Layer w0.406: R63.2 119.83,25.41 CN2.3
$6N9725: length 23.3
  Top Layer w0.406: R62.1 99.4,42.88 v4(99.4,37.03) ; R63.1 v4(106.66,37.03)
  Bottom Layer w0.406: v4(106.66,37.03) v4(99.4,37.03)
$6N9769: length 16.9
  Top Layer w0.406: 111.56,22.87 119.71,22.87 121.04,21.54 ; 111.56,22.87 R76.2 ; 111.56,22.87 111.57,22.86
$6N9770: length 21.3
  Top Layer w0.406: R74.1 105.65,42.48 105.65,35.8 105.24,35.39 104.51,35.39 104.11,34.98 104.11,34.78 104.51,34.37 105.24,34.37 105.65,33.97 105.65,29.52 104.68,28.55 104.68,24.4 R76.1
$6N13257: length 7.9
  Top Layer w0.254: U13.1 66.7,54.04 66.7,51.94 65.93,51.18 U10.7
$6N13266: length 7.7
  Top Layer w0.254: U10.8 65.43,51.25 C61.1 64.74,54.29 U13.2
$6N43759: length 5.4
  Top Layer w0.406: C58.2 84.88,49.66 ; 84.88,49.66 84.86,49.64 U26.13 ; 84.88,49.66 R41.1
$6N43804: length 5.7
  Top Layer w0.305: C69.2 89.89,38.47 R60.1
  Top Layer w0.406: 87.46,41.65 87.46,38.5 R60.1
$6N43807: length 5.8
  Top Layer w0.406: R72.1 84.86,38.5 U26.2 ; 82.17,38.48 82.18,38.47 84.77,38.47
$6N44379: length 5
  Top Layer w0.406: 87.46,49.64 R48.1 ; 87.46,49.64 90.02,49.64 90.04,49.66 ; 87.46,49.64 87.46,47.25
$6N47243: length 8.7
  Top Layer w0.406: R74.2 102.18,43.94 R68.1 102.23,45.77 C83.1 102.23,51.17 U25.6
$6N47251: length 11.8
  Top Layer w0.406: U25.7 103.63,50.42 C83.2 103.63,47.81 104.2,47.24 104.2,45.74 R68.2 104.18,40.03 R73.2
$6N47317: length 7.7
  Top Layer w0.406: U25.13 99.6,59.14 ; 99.6,59.14 99.6,61.73 R46.1 99.62,64.38 R50.2 ; 99.6,59.14 C62.1
$6N47327: length 8.7
  Top Layer w0.406: C62.2 98.17,57.58 U25.14 ; C62.2 98.17,61.2 R46.2 ; C62.2 98.04,59.31 R49.2
$6N47391: length 8.1
  Top Layer w0.406: U25.9 102.2,59.16 ; 102.2,59.16 C54.1 ; 102.2,59.16 102.2,61.73 ; R43.2 102.2,63.39 102.2,61.73 ; 102.2,61.73 R40.1
$6N47423: length 11.4
  Top Layer w0.406: R61.2 95.33,43.11 R59.2 95.33,47.71 C67.2 95.94,48.33 95.94,50.8 96.34,51.19 U25.1
$6N47431: length 10.3
  Top Layer w0.406: U25.2 99.6,48.75 99.12,48.26 97.28,48.26 97.28,45.77 97.36,45.69 R62.2

## Copper pours and planes (outline as drawn; the poured copper is in the pictures)
+3.3V on PWR: 0.5,74.73 127.99,74.73 127.99,0.5 0.5,0.5
+5V on PWR: 8.16,66.76 101.99,66.76 101.99,15.84 8.16,15.84
+12V on Top Layer: 96.33,15.37 98.36,15.37 98.36,12.99 96.33,12.99
AGND on Top Layer: 0.85,74.42 127.95,74.42 127.95,0 0.85,0
AGND on Bottom Layer: 0.69,74.42 127.8,74.42 127.8,0 0.69,0
AGND on GND: 0.5,74.73 127.99,74.73 127.99,0.5 0.5,0.5
D+5V on PWR: 7.01,61.04 65.83,61.04 65.83,25.37 7.01,25.37

## Text on the board
Top Silkscreen Layer: CANH | CANL | +3.3V | SWDIO | SWCLK | AGND | TX | RX | EXC | COSLO | SINLO | SIN | EXC# | COS | D+5V | +12V | +5V | 水下机械臂关节模块 / 旋变解码板v2.2
